# EAGLE design ai_breakout_microusb (EAGLE 7.1.0)
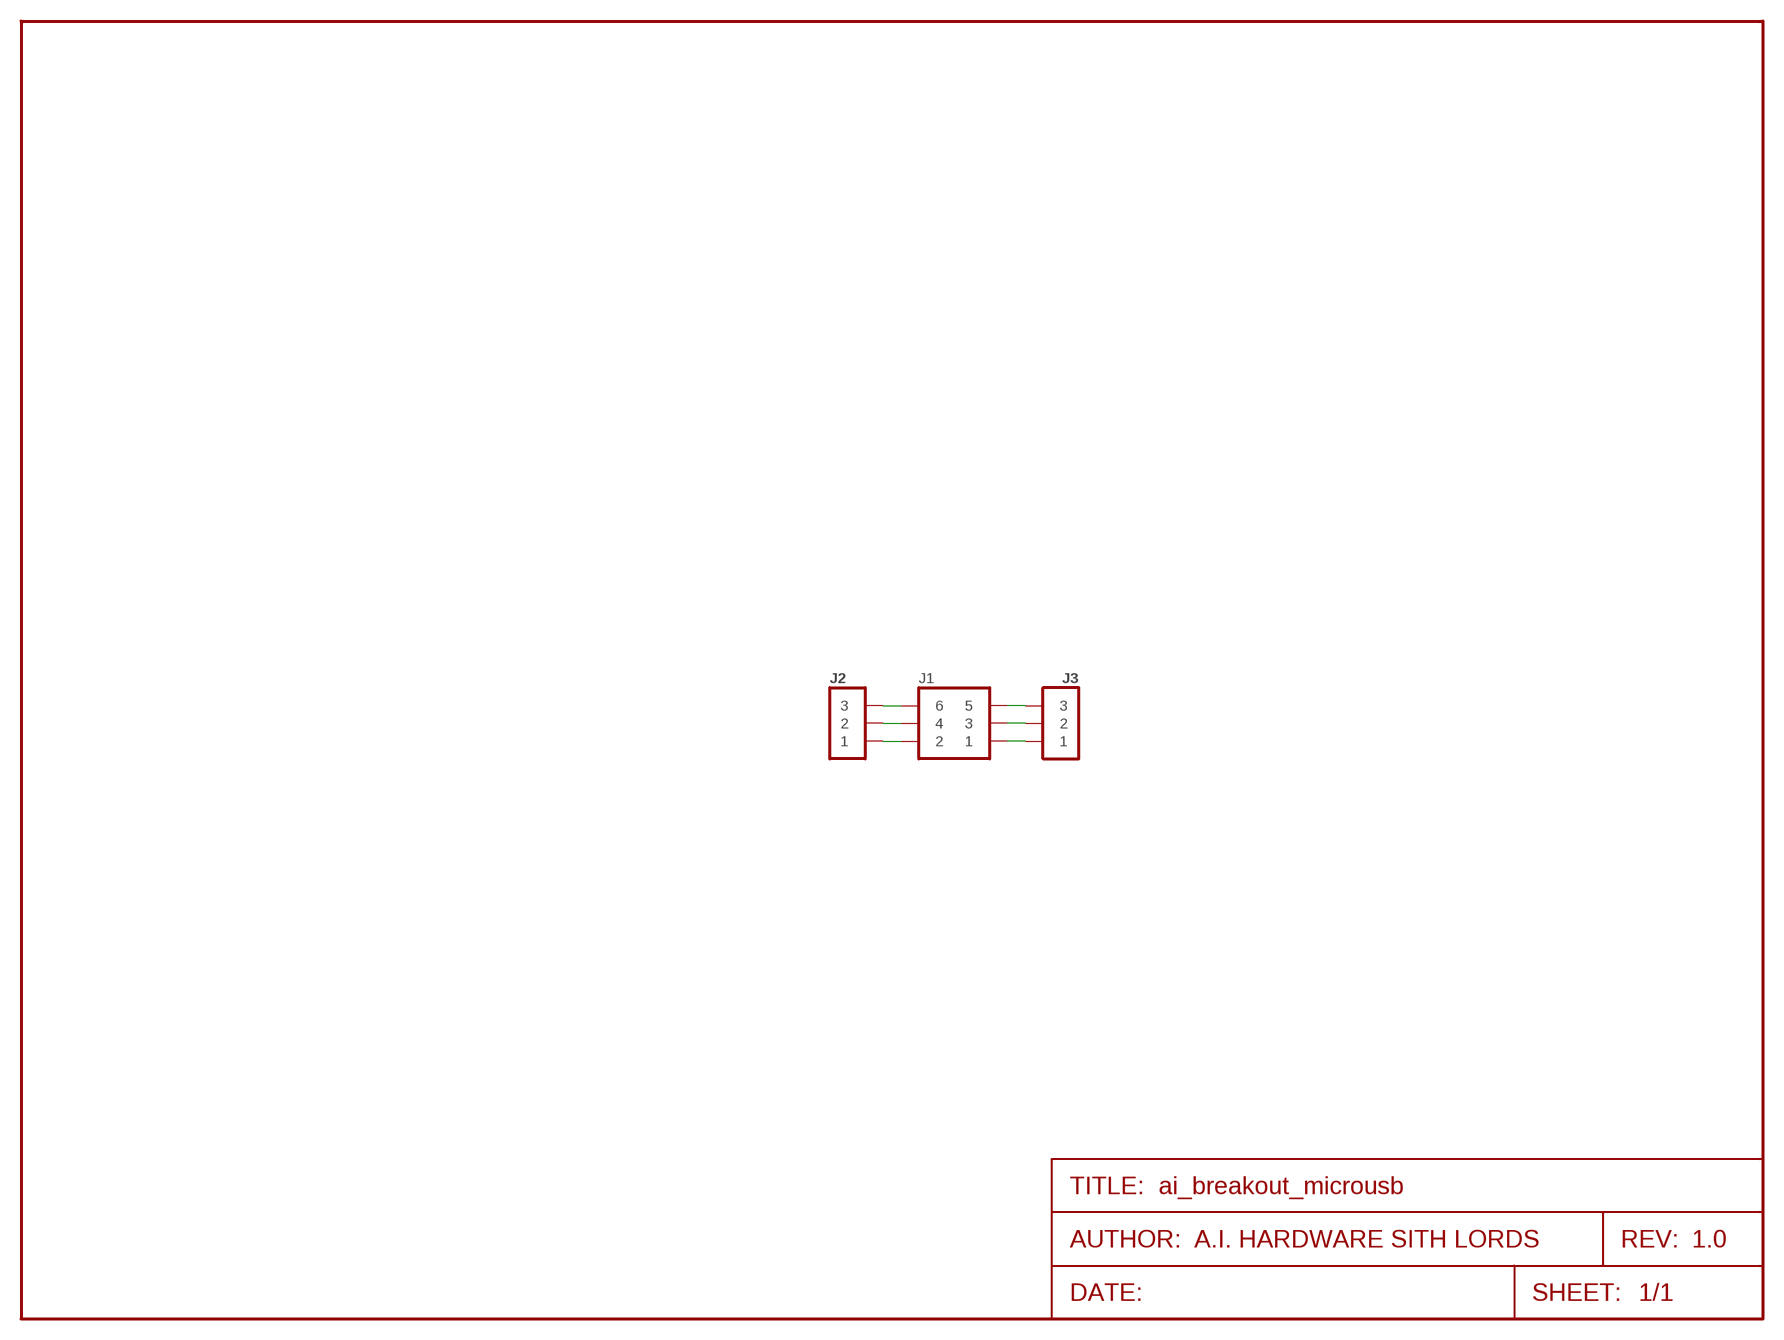
[diagram p0: schematic, sheet 1]
FRAME1 (FRAME-LETTER): AUTHOR: A.I. HARDWARE SITH LORDS; REV: 1.0

## Parts
J1  2X03  [2X03]
J2  1X03NOFIRST  [1X03-NOFIRST]
J3  1X03  [1X03]

## Nets
N$1: J1.1 J3.1
N$2: J1.3 J3.2
N$3: J1.5 J3.3
N$4: J1.2 J2.1
N$5: J1.4 J2.2
N$6: J1.6 J2.3

## Library data of the parts
J1 = Ai_Connectors:2X03
J2 J3 = Ai_Connectors:1X03

## Board
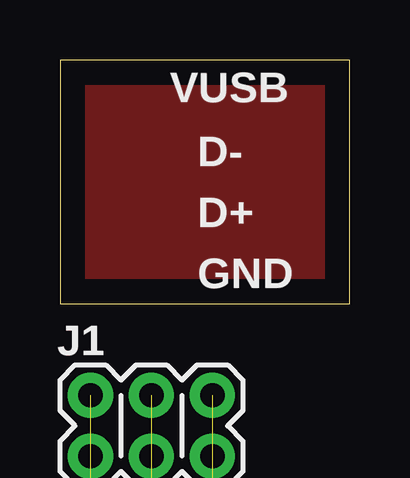
[diagram p1: board, top side]
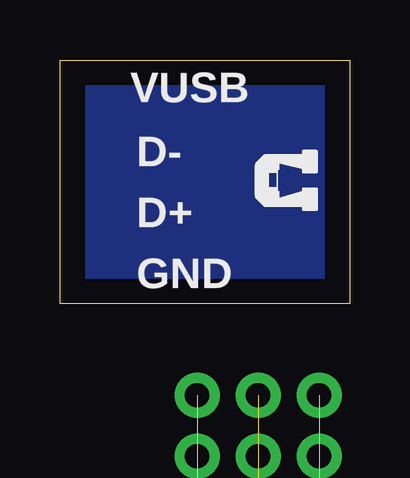
[diagram p2: board, bottom side, seen from below]

Size 12.06 x 10.16 mm. Coordinates in mm from the lower left corner, seen from the top.
Outline: 0,0 12.06,0 12.06,10.16 0,10.16 0,0
Copper layers (1*16): Top 0.035mm / dielectric 1.5mm / Bottom 0.035mm
Design rules "default": minimum track width 10mil, minimum drill 0.6mm, track to track 8mil, track to pad 8mil, pad to pad 8mil, via to via 8mil, smd to smd 8mil, copper to edge 40mil, drill to drill 8mil, minimum pad ring 10mil, minimum via ring 8mil, stop-mask expansion 4mil, vias tented up to drill 0mil, thermal gap 10mil

### Footprints (pad centres in the part's own frame; a part is rotated, then mirrored left to right if it is on the bottom)
2X03 = drill 1.016 pad 1.88: 1 -2.54,-1.27; 2 -2.54,1.27; 3 0,-1.27; 4 0,1.27; 5 2.54,-1.27; 6 2.54,1.27
1X03-NOFIRST = drill 1.016 pad 1.88: 1 -2.54,0; 2 0,0; 3 2.54,0
1X03 = drill 1.016 pad 1.88: 1 -2.54,0; 2 0,0; 3 2.54,0

### Placement (x,y rotation side)
J1  3.81,-5.08 0 top  (outside the outline)
J2  3.81,-17.78 0 top  (outside the outline)
J3  3.81,-12.7 0 top  (outside the outline)
U$1  [AI-LOGO-XS]  1.27,3.81 90 bottom

### Tracks (layer width: path | path; a pad name or v marks a point on that pad's centre or on a via)
GND
  pour Bottom: 0,0 12.06,0 12.06,10.16 0,10.16
  pour Top: 0,0 12.06,0 12.06,10.16 0,10.16
N$1  (1 unrouted)
N$2  (1 unrouted)
N$3  (1 unrouted)
N$4  (1 unrouted)
N$5  (1 unrouted)
N$6  (1 unrouted)

### Text on the board
tNames: VUSB | D- | D+ | GND
bNames: VUSB | D- | D+ | GND